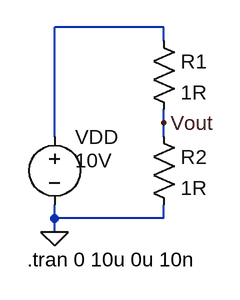
[diagram p0: schematic ResistorDivider.asc]
ResistorDivider.asc, the LTspice schematic file:
Version 4
SHEET 1 880 680
WIRE 224 0 96 0
WIRE 224 16 224 0
WIRE 224 112 224 96
WIRE 96 128 96 0
WIRE 224 128 224 112
WIRE 96 224 96 208
WIRE 224 224 224 208
WIRE 224 224 96 224
WIRE 96 240 96 224
FLAG 96 240 0
FLAG 224 112 Vout
SYMBOL voltage 96 112 R0
WINDOW 3 24 44 Left 2
WINDOW 123 0 0 Left 0
WINDOW 39 0 0 Left 0
SYMATTR Value 10V
SYMATTR InstName VDD
SYMBOL res 208 112 R0
SYMATTR InstName R2
SYMATTR Value 1R
SYMBOL res 208 0 R0
SYMATTR InstName R1
SYMATTR Value 1R
TEXT 64 272 Left 2 !.tran 0 10u 0u 10n

The netlist it stands for:
* ResistorDivider.asc
VDD N001 0 10V
R2 Vout 0 1R
R1 N001 Vout 1R
.tran 0 10u 0u 10n
.backanno
.end